# Altium schematic sheet NewBoat.SchDoc
size A4
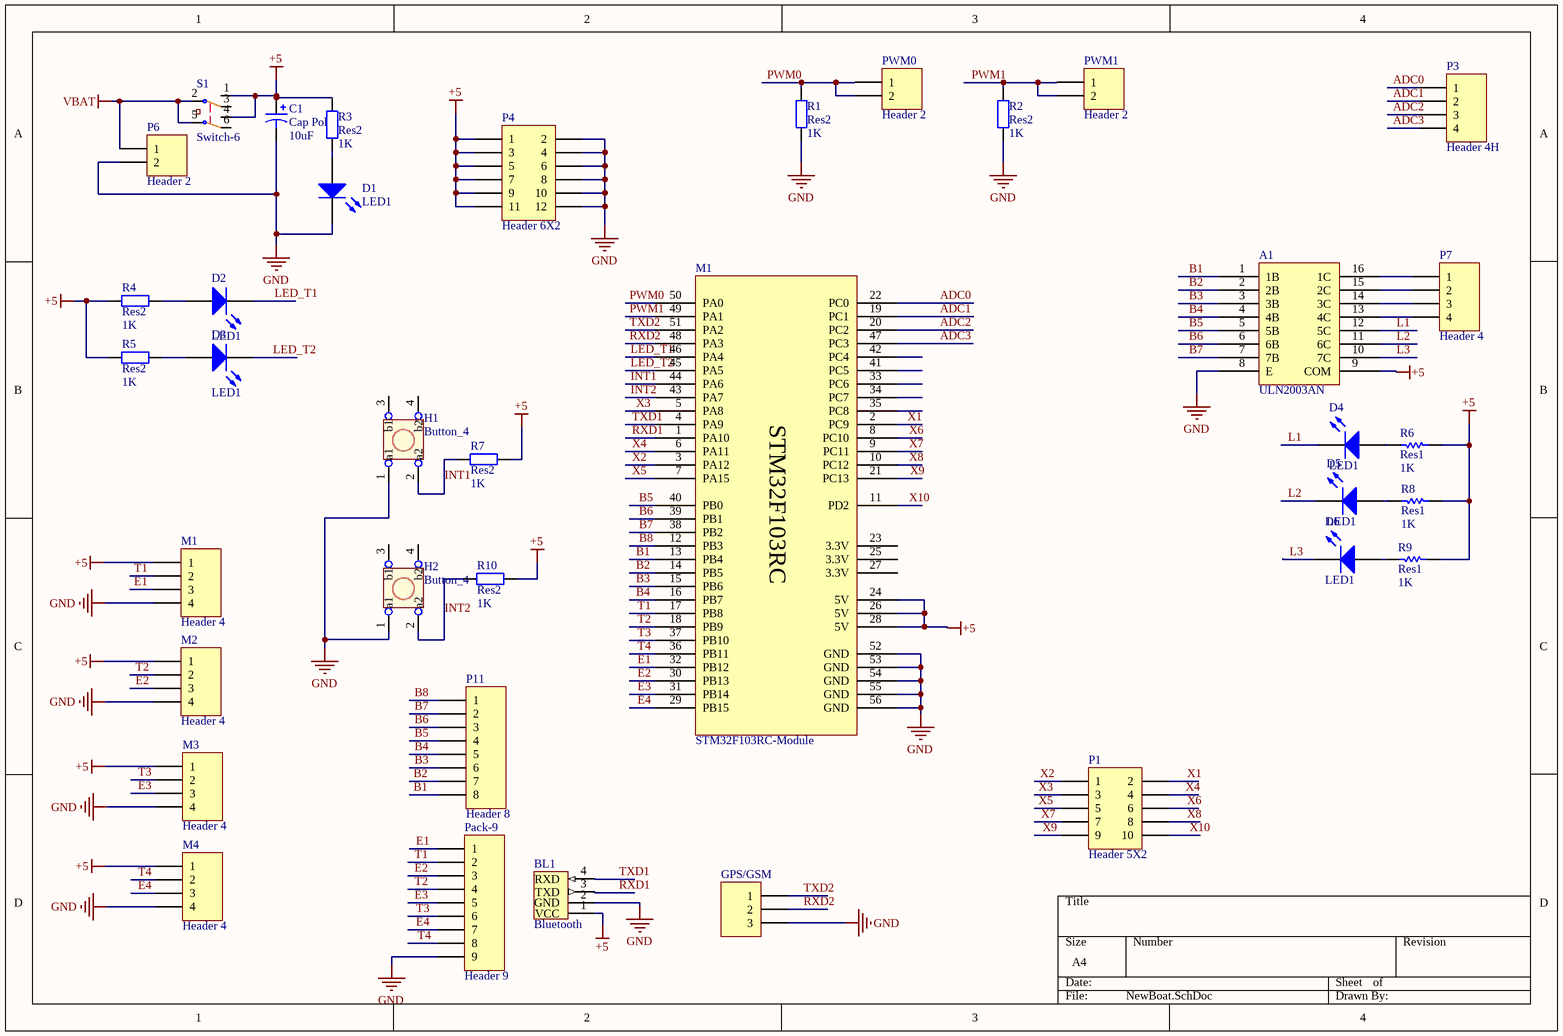
[diagram p0: NewBoat.SchDoc]

## Parts
(Parts that share a designator on the sheet are numbered #1, #2 ... from top to bottom, then left to right.)
A1  ULN2003AN  [DIP16]
BL1  Bluetooth  [Row stitch-4]
C1  Cap Pol  value 10uF  [cap-3.0]
D1  LED1  [LED-1]
D2  LED1  [LED-1]
D3  LED1  [LED-1]
D4  LED1  [LED-1]
D5  LED1  [LED-1]
D6  LED1  [LED-1]
GPS/GSM  (no value)  [HDR1X3]
H1  Button_4  [Button_4]
H2  Button_4  [Button_4]
M1#1  Header 4  [HDR1X4]
M1#2  STM32F103RC-Module  [STM32F103RC]
M2  Header 4  [HDR1X4]
M3  Header 4  [HDR1X4]
M4  Header 4  [HDR1X4]
P1  Header 5X2  [HDR2X5]
P3  Header 4H  [HDR1X4]
P4  Header 6X2  [HDR2X6]
P6  Header 2  [HDR1X2]
P7  Header 4  [HDR1X4]
P11  Header 8  [HDR1X8]
Pack-9  Header 9  [HDR1X9]
PWM0  Header 2  [HDR1X2]
PWM1  Header 2  [HDR1X2]
R1  Res2  value 1K  [AXIAL-8mm]
R2  Res2  value 1K  [AXIAL-8mm]
R3  Res2  value 1K  [AXIAL-8mm]
R4  Res2  value 1K  [AXIAL-8mm]
R5  Res2  value 1K  [AXIAL-8mm]
R6  Res1  value 1K  [AXIAL-0.3]
R7  Res2  value 1K  [AXIAL-8mm]
R8  Res1  value 1K  [AXIAL-0.3]
R9  Res1  value 1K  [AXIAL-0.3]
R10  Res2  value 1K  [AXIAL-8mm]
S1  Switch-6  [Switch-6]

## Nets
+5: A1.9(COM) BL1.1(VCC) C1.1 M1#1.1 M1#2.24(5V) M1#2.26(5V) M1#2.28(5V) M2.1 M3.1 M4.1 P4.1 P4.3 P4.5 P4.7 P4.9 P4.11 R3.2 R4.2 R5.2 R6.1 R7.2 R8.1 R9.1 R10.2 S1.1 S1.4
GND: A1.8(E) BL1.2(GND) C1.2 D1.2(K) GPS/GSM.3 H1.1(a1) H2.1(a1) M1#1.4 M1#2.52(GND) M1#2.53(GND) M1#2.54(GND) M1#2.55(GND) M1#2.56(GND) M2.4 M3.4 M4.4 P4.2 P4.4 P4.6 P4.8 P4.10 P4.12 P6.2 Pack-9.9 R1.1 R2.1
VBAT: P6.1 S1.2 S1.5
ADC0: M1#2.22(PC0) P3.1
ADC1: M1#2.19(PC1) P3.2
ADC2: M1#2.20(PC2) P3.3
ADC3: M1#2.47(PC3) P3.4
B1: A1.1(1B) M1#2.13(PB4) P11.8
B2: A1.2(2B) M1#2.14(PB5) P11.7
B3: A1.3(3B) M1#2.15(PB6) P11.6
B4: A1.4(4B) M1#2.16(PB7) P11.5
B5: A1.5(5B) M1#2.40(PB0) P11.4
B6: A1.6(6B) M1#2.39(PB1) P11.3
B7: A1.7(7B) M1#2.38(PB2) P11.2
B8: M1#2.12(PB3) P11.1
E1: M1#1.3 M1#2.32(PB12) Pack-9.1
E2: M1#2.30(PB13) M2.3 Pack-9.3
E3: M1#2.31(PB14) M3.3 Pack-9.5
E4: M1#2.29(PB15) M4.3 Pack-9.7
INT1: H1.2(a2) M1#2.44(PA6) R7.1
INT2: H2.2(a2) M1#2.43(PA7) R10.1
L1: A1.12(5C) D4.2(K)
L2: A1.11(6C) D5.2(K)
L3: A1.10(7C) D6.2(K)
LED_T1: D2.2(K) M1#2.46(PA4)
LED_T2: D3.2(K) M1#2.45(PA5)
PWM0: M1#2.50(PA0) PWM0.1 PWM0.2 R1.2
PWM1: M1#2.49(PA1) PWM1.1 PWM1.2 R2.2
RXD1: BL1.3(TXD) M1#2.1(PA10)
RXD2: GPS/GSM.2 M1#2.48(PA3)
T1: M1#1.2 M1#2.17(PB8) Pack-9.2
T2: M1#2.18(PB9) M2.2 Pack-9.4
T3: M1#2.37(PB10) M3.2 Pack-9.6
T4: M1#2.36(PB11) M4.2 Pack-9.8
TXD1: BL1.4(RXD) M1#2.4(PA9)
TXD2: GPS/GSM.1 M1#2.51(PA2)
X1: M1#2.2(PC9) P1.2
X2: M1#2.3(PA12) P1.1
X3: M1#2.5(PA8) P1.3
X4: M1#2.6(PA11) P1.4
X5: M1#2.7(PA15) P1.5
X6: M1#2.8(PC10) P1.6
X7: M1#2.9(PC11) P1.7
X8: M1#2.10(PC12) P1.8
X9: M1#2.21(PC13) P1.9
X10: M1#2.11(PD2) P1.10
NetA1_13: A1.13(4C) P7.4
NetA1_14: A1.14(3C) P7.3
NetA1_15: A1.15(2C) P7.2
NetA1_16: A1.16(1C) P7.1
NetD1_1: D1.1(A) R3.1
NetD2_1: D2.1(A) R4.1
NetD3_1: D3.1(A) R5.1
NetD4_1: D4.1(A) R6.2
NetD5_1: D5.1(A) R8.2
NetD6_1: D6.1(A) R9.2

Not connected (* = marked no-connect by the designer): H1 3(b1) 4(b2); H2 3(b1) 4(b2); M1#2 23(3.3V) 25(3.3V) 27(3.3V) 33(PC6) 34(PC7) 35(PC8) 41(PC5) 42(PC4); S1 3 6

## Notes on the sheet
- (in symbol STM32F103RC-Module) STM32F103RC

## Library data of the parts
C1 = Cap Pol: Polarized Capacitor (Axial); Published: 8-Jun-2000; LatestRevisionDate: 17-Jul-2002; LatestRevisionNote: Re-released for DXP Platform.; PackageReference: POLAR0.8; Publisher: Altium Limited; PackageDescription: Polarized Capacitor; 2 Leads
D1-D6 = LED1: Typical RED GaAs LED; Published: 8-Jun-2000; LatestRevisionDate: 08-Jul-2005; LatestRevisionNote: Mech Layer 1 removed.; PackageReference: LED-1; Publisher: Altium Limited; PackageDescription: LED; 2 Leads
GPS/GSM = Header 3: Header, 3-Pin; LatestRevisionDate: 17-Jul-2002; LatestRevisionNote: Re-released for DXP Platform.; Publisher: Altium Limited
M1#1 M2-M4 P7 = Header 4: Header, 4-Pin; LatestRevisionDate: 17-Jul-2002; LatestRevisionNote: Re-released for DXP Platform.; Publisher: Altium Limited
P1 = Header 5X2: Header, 5-Pin, Dual row; LatestRevisionDate: 17-Jul-2002; LatestRevisionNote: Re-released for DXP Platform.; Publisher: Altium Limited
P3 = Header 4H: Header, 4-Pin, Right Angle; LatestRevisionDate: 17-Jul-2002; LatestRevisionNote: Re-released for DXP Platform.; Publisher: Altium Limited
P4 = Header 6X2: Header, 6-Pin, Dual row; LatestRevisionDate: 17-Jul-2002; LatestRevisionNote: Re-released for DXP Platform.; Publisher: Altium Limited
P6 PWM0 PWM1 = Header 2: Header, 2-Pin; LatestRevisionDate: 17-Jul-2002; LatestRevisionNote: Re-released for DXP Platform.; Publisher: Altium Limited
P11 = Header 8: Header, 8-Pin; LatestRevisionDate: 17-Jul-2002; LatestRevisionNote: Re-released for DXP Platform.; Publisher: Altium Limited
Pack-9 = Header 9: Header, 9-Pin; LatestRevisionDate: 17-Jul-2002; LatestRevisionNote: Re-released for DXP Platform.; Publisher: Altium Limited
R1-R5 R7 R10 = Res2: Resistor; Published: 8-Jun-2000; LatestRevisionDate: 17-Jul-2002; LatestRevisionNote: Re-released for DXP Platform.; PackageReference: AXIAL-0.4; Publisher: Altium Limited; PackageDescription: Axial Device, Thru-Hole; 2 Leads; 0.4 in Pin Spacing
R6 R8 R9 = Res1: Resistor; Published: 8-Jun-2000; LatestRevisionDate: 17-Jul-2002; LatestRevisionNote: Re-released for DXP Platform.; PackageReference: AXIAL-0.3; Publisher: Altium Limited; PackageDescription: Axial Device, Thru-Hole; 2 Leads; 0.3 in Pin Spacing